# EAGLE design peripheral (EAGLE 8.6.0)
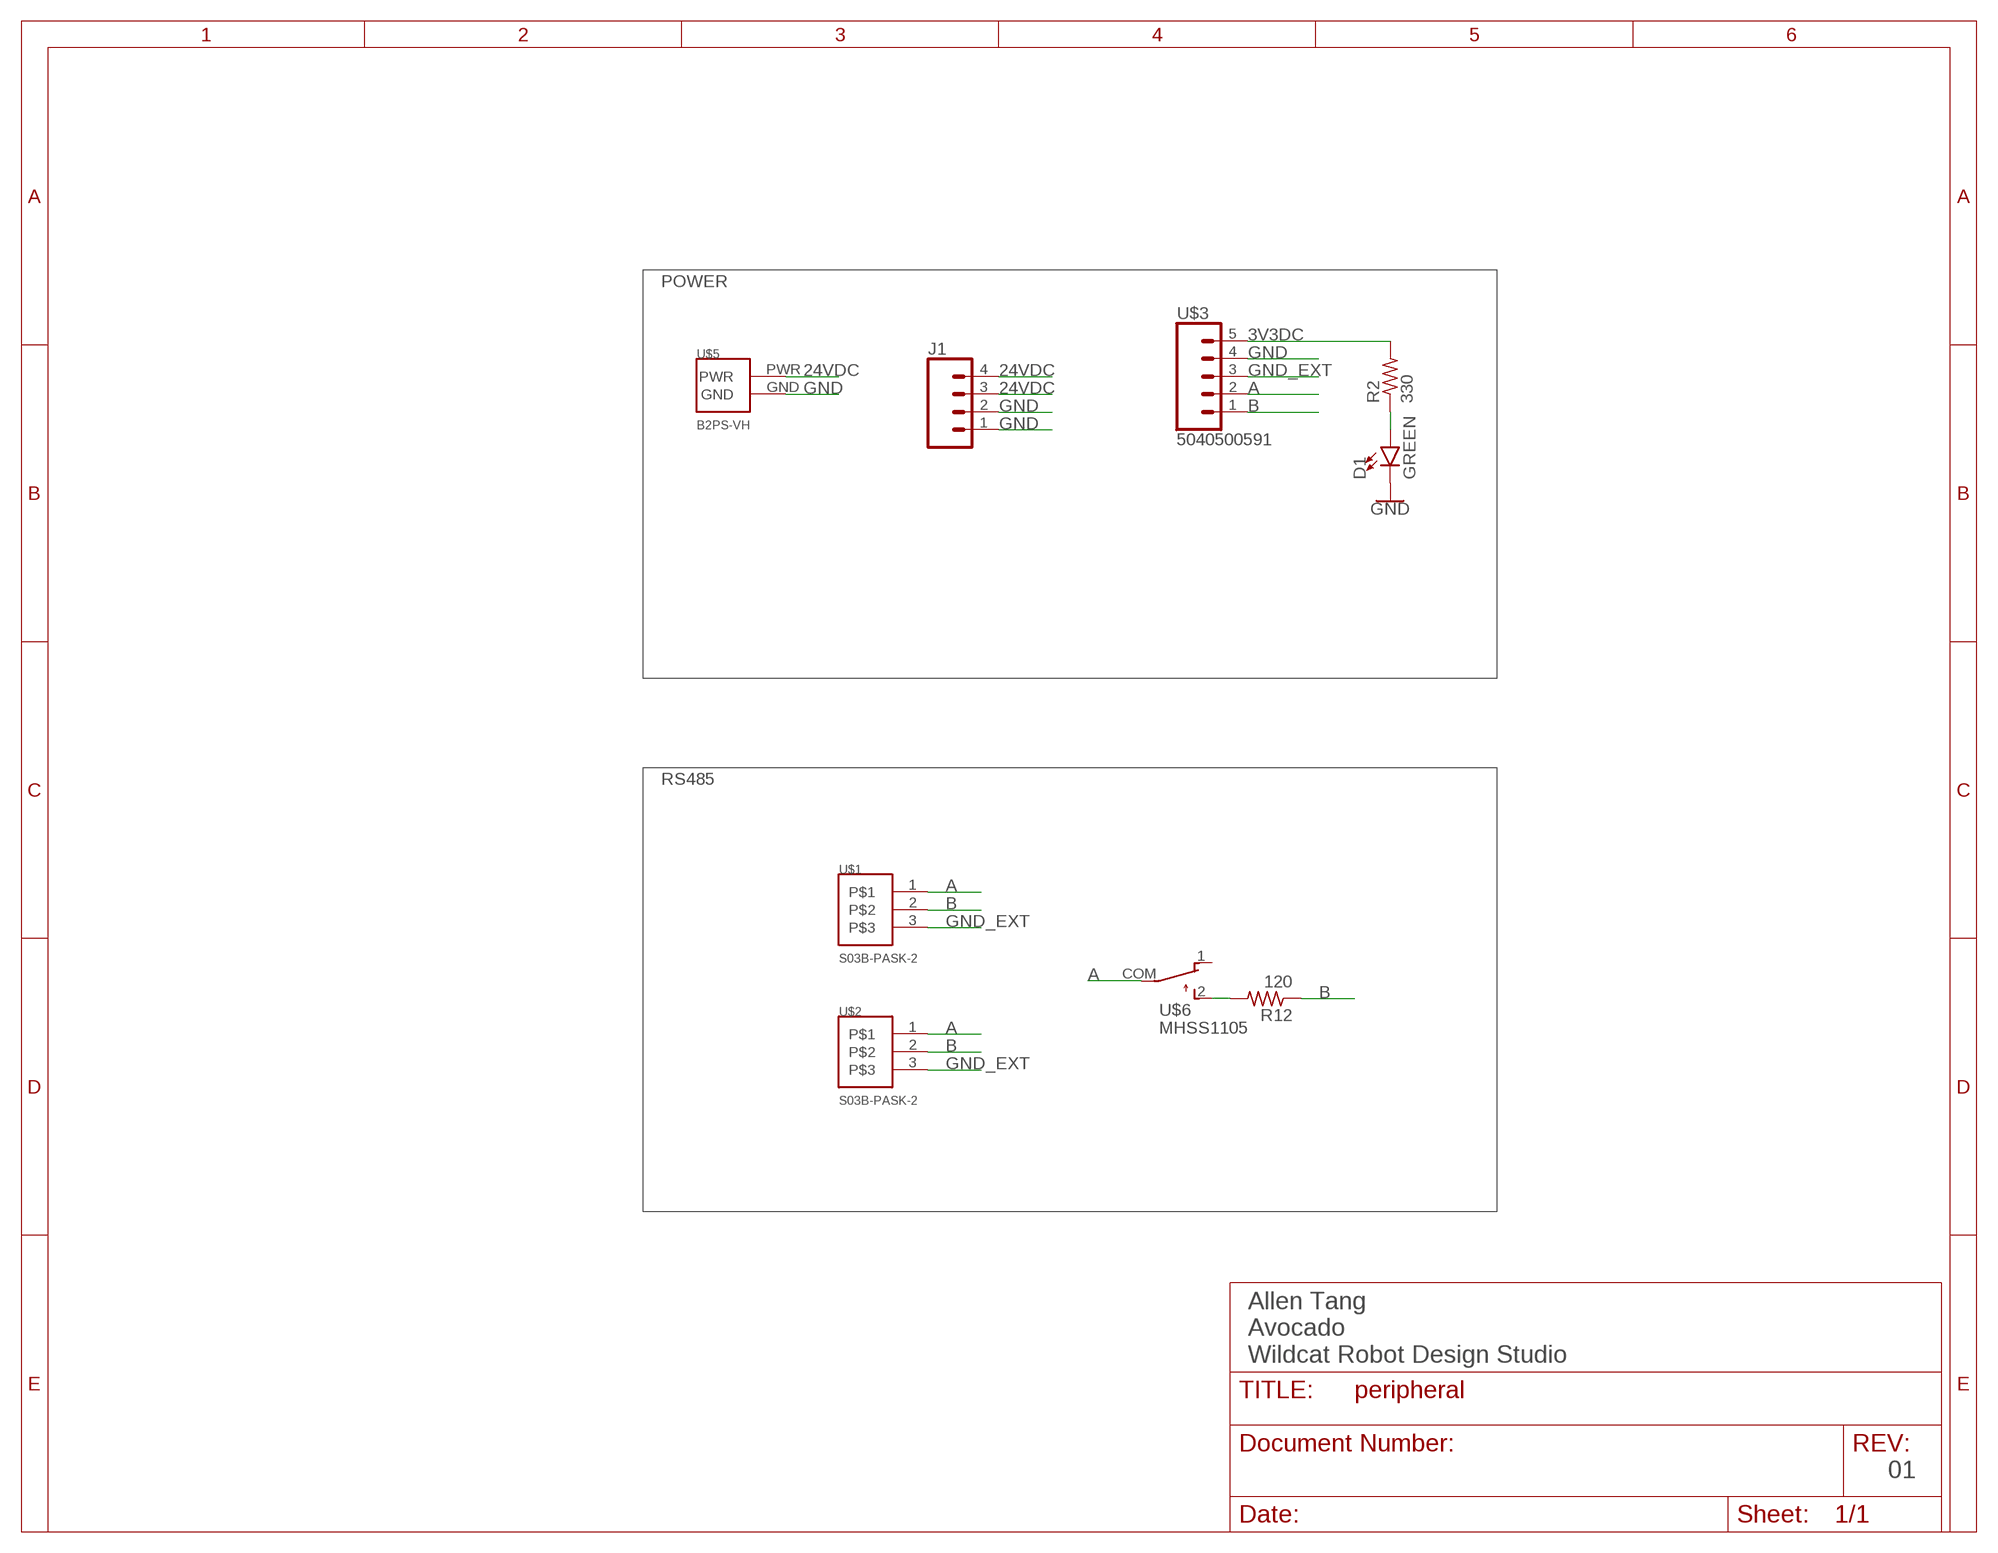
[diagram p0: schematic, sheet 1]

## Parts
D1  GREEN  LED-GREEN0603  [LED-0603]
J1  CONN_04  [1X04]
R2  330  R-US_R0805  [R0805]
R12  120  R-US_R0805  [R0805]
U$1  S03B-PASK-2  [S03B-PASK-2]
U$2  S03B-PASK-2  [S03B-PASK-2]
U$3  5040500591  [5040500591]
U$5  B2PS-VH  [B2PS-VH]
U$6  MHSS1105  [MHSS1105]

## Nets
3V3DC: R2.2 U$3.5
24VDC: J1.3 J1.4 U$5.PWR
A: U$1.1 U$2.1 U$3.2 U$6.COM
B: R12.1 U$1.2 U$2.2 U$3.1
GND: D1.C J1.1 J1.2 U$3.4 U$5.GND
GND_EXT: U$1.3 U$2.3 U$3.3
N$1: D1.A R2.1
N$18: R12.2 U$6.2
Unconnected: U$6.1

## Notes on the sheet
- POWER
- RS485
- Allen Tang
  Avocado
  Wildcat Robot Design Studio
- 01

## Library data of the parts
D1 = SparkFun-LED:LED-GREEN: Green SMD LED Used in manufacturing of various products at SparkFun Packages: 0603 - SMD 0603 package [Product Link] <http://www.futureelectronics.com/en/technologies/semiconductors/optoelectronics/leds/Pages/9894312-LTST-C190GKT.aspx?CrossPart=HSMG-C190&IM=0> LilyPad 1206 - SMD1206 LilyPad package [Product Link] <http://www.futureelectronics.com/en/Technologies/Product.aspx?ProductID=IN150NGHARVATEKCORPORATION2049943&IM=0> 1206 - SMD1206 package [Product Link] <http://www.futureelectronics.com/en/technologies/semiconductors/optoelectronics/leds/Pages/8315665-LTST-C150KGKT.aspx?IM=0> 1206 Bottom Mount -SMD 1206 Bottom Mount [Product Link] <http://www.digikey.com/product-detail/en/lite-on-inc/LTST-C230KGKT/160-1456-1-ND/386854> SparkFun Products: Pro Mini 328 -5V <https://www.sparkfun.com/products/821> RedBoard <https://www.sparkfun.com/products/12757> MP3 Trigger <https://www.sparkfun.com/products/13720> Makey Makey <https://www.sparkfun.com/products/11076>; PROD_ID: DIO-00821
J1 = SparkFun-Connectors:CONN_04: Multi connection point. Often used as Generic Header-pin footprint for 0.1 inch spaced/style header connections On any of the 0.1 inch spaced packages, you can populate with these: Break Away Headers - Straight <https://www.sparkfun.com/products/116> (PRT-00116) Break Away Male Headers - Right Angle <https://www.sparkfun.com/products/553> (PRT-00553) Female Headers <https://www.sparkfun.com/products/115> (PRT-00115) Break Away Headers - Machine Pin <https://www.sparkfun.com/products/117> (PRT-00117) Break Away Female Headers - Swiss Machine Pin <https://www.sparkfun.com/products/743> (PRT-00743) For SCREWTERMINALS and SPRING TERMINALS visit here: Screw Terimnals on SparkFun.com <https://www.sparkfun.com/search/results?term=Screw+Terminals> (5mm/3.5mm/2.54mm spacing) This device is also useful as a general connection point to wire up your design to another part of your project. Our various solder wires solder well into these plated through hole pads. Hook-Up Wire - Assortment (Stranded, 22 AWG) <https://www.sparkfun.com/products/11375> (PRT-11375) Hook-Up Wire - Assortment (Solid Core, 22 AWG) <https://www.sparkfun.com/products/11367> (PRT-11367) View the entire wire category on our website here <https://www.sparkfun.com/categories/141> Special notes: Molex polarized connector foot print use with SKU : PRT-08231 with associated crimp pins and housings. 1MM SMD Version SKU: PRT-10208; PROD_ID: CONN-09696
R2 R12 = rcl:R-US_: RESISTOR, American symbol; SPICEPREFIX: R
U$1 U$2 = avocado:S03B-PASK-2: JST PA SERIES, 3 POS
U$3 = avocado:5040500591
U$5 = avocado:B2PS-VH: JST VH, 2 POS
U$6 = avocado:MHSS1105: MHSS1105 Slide Switch

## Board
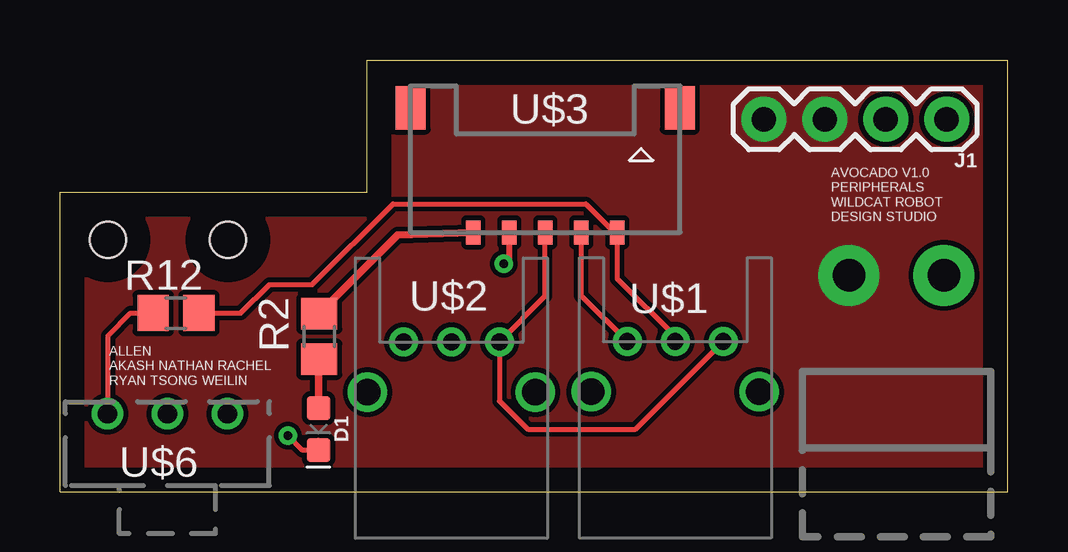
[diagram p1: board, top side]
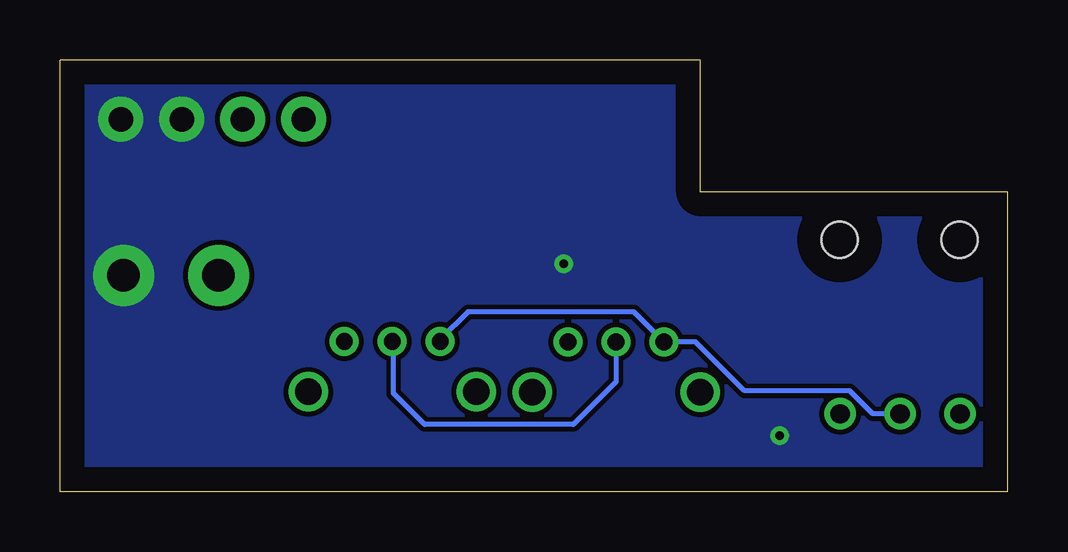
[diagram p2: board, bottom side, seen from below]

Size 39.5 x 18 mm. Coordinates in mm from the lower left corner, seen from the top.
Outline: 0,0 39.5,0 39.5,18 12.8,18 12.8,12.5 0,12.5 0,0
Copper layers (1*16): Top 0.035mm / dielectric 1.5mm / Bottom 0.035mm
Design rules "default *": minimum track width 8mil, minimum drill 0.35mm, track to track 8mil, track to pad 8mil, pad to pad 8mil, via to via 8mil, smd to smd 8mil, copper to edge 40mil, drill to drill 8mil, minimum pad ring 10mil, minimum via ring 8mil, stop-mask expansion 4mil, vias tented up to drill 0mil, thermal gap 10mil
Holes 1.5 mm at 2,10.5 7,10.5

### Footprints (pad centres in the part's own frame; a part is rotated, then mirrored left to right if it is on the bottom)
LED-0603 = smd 1 x 1: A -0.877,0; C 0.877,0
1X04 = drill 1.016 pad 1.88: 1 0,0; 2 2.54,0; 3 5.08,0; 4 7.62,0
R0805 = smd 1.3 x 1.5: 1 -0.95,0; 2 0.95,0
S03B-PASK-2 = drill 0.7: 1 2,0; 2 0,0; 3 -2,0 | drill 1.1: P$4 -3.5,2.1; P$5 3.5,2.1
5040500591 = smd 0.6 x 1: 1 3,-2.54; 2 1.5,-2.54; 3 0,-2.54; 4 -1.5,-2.54; 5 -3,-2.54 | smd 1.25 x 1.8: P$7 5.605,2.65; P$8 -5.605,2.65
B2PS-VH = drill 1.35 pad 2.54: GND -1.98,0; PWR 1.98,0
MHSS1105 = drill 0.8: 1 -2.5,0; 2 2.5,0; COM 0,0

### Placement (x,y rotation side)
D1  10.78,2.61 270 top
J1  36.96,15.53 180 top
R2  10.81,6.47 90 top
R12  4.84,7.44 180 top
U$1  25.65,6.26 180 top
U$2  16.32,6.24 180 top
U$3  20.23,13.35 0 top
U$5  34.87,9.02 180 top
U$6  4.48,3.24 180 top

### Tracks (layer width: path | path; a pad name or v marks a point on that pad's centre or on a via)
3V3DC
  Top 0.305: R2.2 14.08,10.69 U$3.5
24VDC
  pour Top (no thermals): 0.05,19.16 41.41,19.09 41.36,-0.07 0,0
A
  Top 0.203: U$1.1 21.73,8.18 U$3.2
  Bottom 0.203: U$6.COM 5.62,3.24 6.58,4.2 10.96,4.2 13.01,6.25 U$2.1 15.57,7.5 22.5,7.5 23.65,6.35 U$1.1
B
  Top 0.203: 23.23,10.69 U$3.1 | 23.23,10.69 21.92,12 13.88,12 10.51,8.63 8.73,8.63 7.54,7.44 R12.1 | 23.23,10.69 23.23,8.88 25.65,6.46 U$1.2
  Bottom 0.203: U$2.2 16.32,4.58 18.1,2.8 24.3,2.8 25.6,4.1 25.6,6.21 U$1.2
GND  (via drill 0.35)
  Top 0.203: v9.5,2.33 10.11,1.73 D1.C 10.78,2.14
  Top 0.254: U$3.4 18.73,9.73 v18.5,9.5
  pour Bottom (no thermals): -0.05,19.09 41.85,19.12 41.9,0.04 0,0
GND_EXT
  Top 0.203: U$1.3 23.99,2.6 19.5,2.6 18.32,3.78 U$2.3 20.23,8.15 U$3.3
N$1
  Top 0.305: D1.A 10.78,5.48 R2.1
N$18
  Top 0.203: U$6.2 2,3.26 2,6.5 2.94,7.44 R12.2

### Text on the board
tPlace: AVOCADO V1.0 / PERIPHERALS / WILDCAT ROBOT / DESIGN STUDIO | ALLEN / AKASH NATHAN RACHEL / RYAN TSONG WEILIN